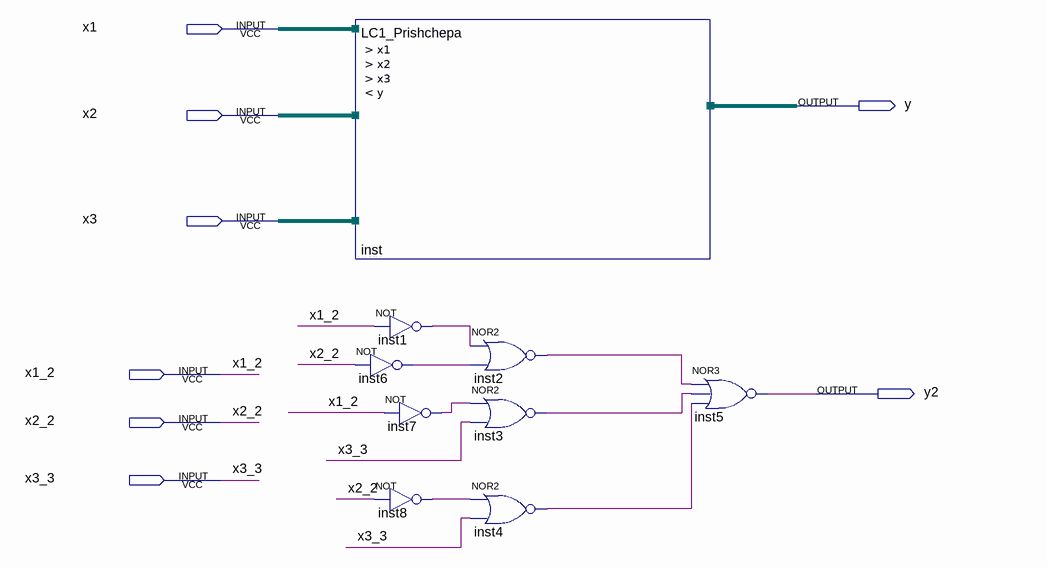
[diagram p0: schematic sheet]
// Quartus schematic Prishchepa_Vladislav.bdf as structural Verilog: 9 symbols, 8 pins
module Prishchepa_Vladislav (
  input  x1,
  input  x2,
  input  x3,
  input  x1_2,
  input  x2_2,
  input  x3_3,
  output y,
  output y2
);

  wire inst1_out, inst2_out, inst3_out, inst4_out, inst6_out, inst7_out, inst8_out;

  LC1_Prishchepa inst (.x1(x1), .x2(x2), .x3(x3), .y(y));
  not inst1 (inst1_out, x1_2);
  not inst6 (inst6_out, x2_2);
  not inst8 (inst8_out, x2_2);
  not inst7 (inst7_out, x1_2);
  nor inst2 (inst2_out, inst1_out, inst6_out);
  nor inst3 (inst3_out, inst7_out, x3_3);
  nor inst4 (inst4_out, inst8_out, x3_3);
  nor inst5 (y2, inst2_out, inst3_out, inst4_out);
endmodule
